# Altium schematic sheet MIPI_FLAT_22PIN.SchDoc: MIPI FLAT 22 PIN
size A3; Author: Silvio Navaretti; CompanyName: ARDUINO; DrawnBy: Silvio Navaretti; Engineer: Silvio Navaretti; Organization: ARDUINO; SheetNumber: 43; SheetTotal: 51; RevAuthor: Silvio Navaretti
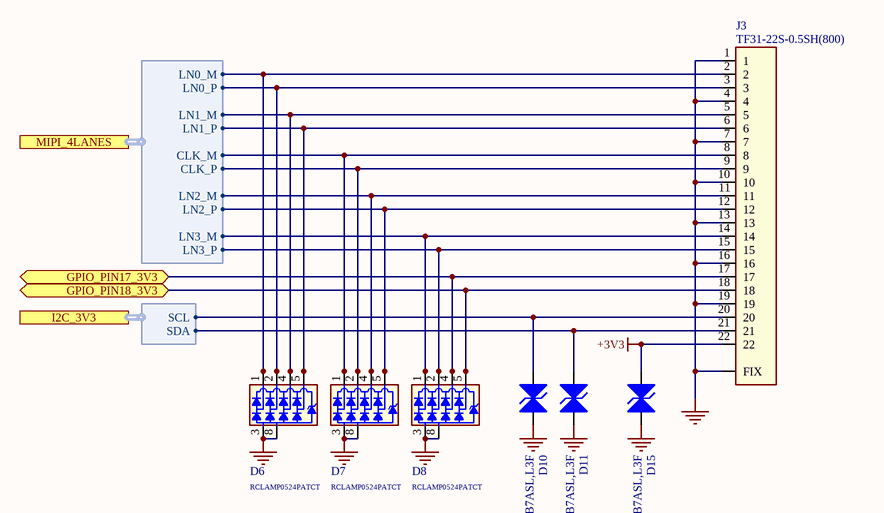
[diagram p0: MIPI_FLAT_22PIN.SchDoc]

## Parts
D6  RCLAMP0524PATCT  [SLP2510P8]
D7  RCLAMP0524PATCT  [SLP2510P8]
D8  RCLAMP0524PATCT  [SLP2510P8]
D10  DF2B7ASL,L3F  [DF2B7ASL,L3F]
D11  DF2B7ASL,L3F  [DF2B7ASL,L3F]
D15  DF2B7ASL,L3F  [DF2B7ASL,L3F]
J3  TF31-22S-0.5SH(800)  [TF31-22S-0.5SH(800)]

## Ports
GPIO_PIN17_3V3 (bidir), GPIO_PIN18_3V3 (bidir), I2C_3V3 (harness I2C), MIPI_4LANES (harness MIPI_4LANES)

## Harnesses
MIPI_4LANES: LN3_M, LN2_M, LN2_P, LN0_M, LN0_P, CLK_M, CLK_P, LN1_M, LN1_P, LN3_P
I2C: SDA, SCL

## Nets
+3V3: D15.2(A2) J3.22
GND: D6.3 D6.8 D7.3 D7.8 D8.3 D8.8 D10.1(A1) D11.1(A1) D15.1(A1) J3.1 J3.4 J3.7 J3.10 J3.13 J3.16 J3.19 J3.FIX
GPIO_PIN17_3V3: D8.4 D8.7 J3.17 ; port GPIO_PIN17_3V3
GPIO_PIN18_3V3: D8.5 D8.6 J3.18 ; port GPIO_PIN18_3V3
NetD6_1: D6.1 D6.10 J3.2 ; port MIPI_4LANES.LN0_M
NetD6_2: D6.2 D6.9 J3.3 ; port MIPI_4LANES.LN0_P
NetD6_4: D6.4 D6.7 J3.5 ; port MIPI_4LANES.LN1_M
NetD6_5: D6.5 D6.6 J3.6 ; port MIPI_4LANES.LN1_P
NetD7_1: D7.1 D7.10 J3.8 ; port MIPI_4LANES.CLK_M
NetD7_2: D7.2 D7.9 J3.9 ; port MIPI_4LANES.CLK_P
NetD7_4: D7.4 D7.7 J3.11 ; port MIPI_4LANES.LN2_M
NetD7_5: D7.5 D7.6 J3.12 ; port MIPI_4LANES.LN2_P
NetD8_1: D8.1 D8.10 J3.14 ; port MIPI_4LANES.LN3_M
NetD8_2: D8.2 D8.9 J3.15 ; port MIPI_4LANES.LN3_P
NetD10_2: D10.2(A2) J3.20 ; port I2C_3V3.SCL
NetD11_2: D11.2(A2) J3.21 ; port I2C_3V3.SDA

## Notes on the sheet
- Title:
- ID:
- Date:
- Time:
- Version:
- Sheet
- of
- RevAuthor:
- Reference Designs ARE PROVIDED "AS IS" AND "WITH ALL FAULTS. Arduino SA DISCLAIMS ALL OTHER WARRANTIES, EXPRESS OR IMPLIED, REGARDING PRODUCTS, INCLUDING BUT NOT LIMITED TO, ANY IMPLIED WARRANTIES OF MERCHANTABILITY OR FITNESS FOR A PARTICULAR PURPOSE.
  Arduino SA may make changes to specifications and product descriptions at any time, without notice. The Customer must not rely on the absence or characteristics of any features or instructions marked "reserved" or "undefined".
  Arduino SA reserves these for future definition and shall have no responsibility whatsoever for conflicts or incompatibilities arising from future changes to them. The product information on the Web Site or Materials is subject to change without notice.
  Do not finalize a design with this info. ARDUINO and other Arduino brands and logos and Trademarks of Arduino SA. All Arduino SA Trademarks cannot be used without owner's formal permission.
- File:
- Author:

## Library data of the parts
D6-D8 = D0097-A.6: TVS UNIDIRECTIONAL 4CH 0.8pF 5V SLP2510P8 10-pin 2.5x1.0x0.58mm; Manufacturer: SEMTECH; Code Arduino: D0097; Device Type: ESD protection; Part Number: RCLAMP0524PATCT
D10 D11 D15 = D0099-5: TVS BIDIRECTIONAL SMD Vr 5.5V, Vbr min 5.8V, 0.62x0.32mm; Manufacturer: TOSHIBA; Vforward max: 0V; Ireverse max: 1µA; Power max: 80W; Code Arduino: D0099; Vreverse max: 20V; V(BR) min: 5.8V; V(RWM) max: 5.5V; Part Number: DF2B7ASL,L3F
J3 = J0553-A.2: CONN FFC/FPC Connector, 22 Contact(s), 1 Row(s), BOTTOM CONTACT, Female, Right Angle, 0.5mm Pitch; Manufacturer: Hirose; Code Arduino: J0553; Part Number: TF31-22S-0.5SH(800)